# EAGLE design tms-rgb (EAGLE 9.5.1)
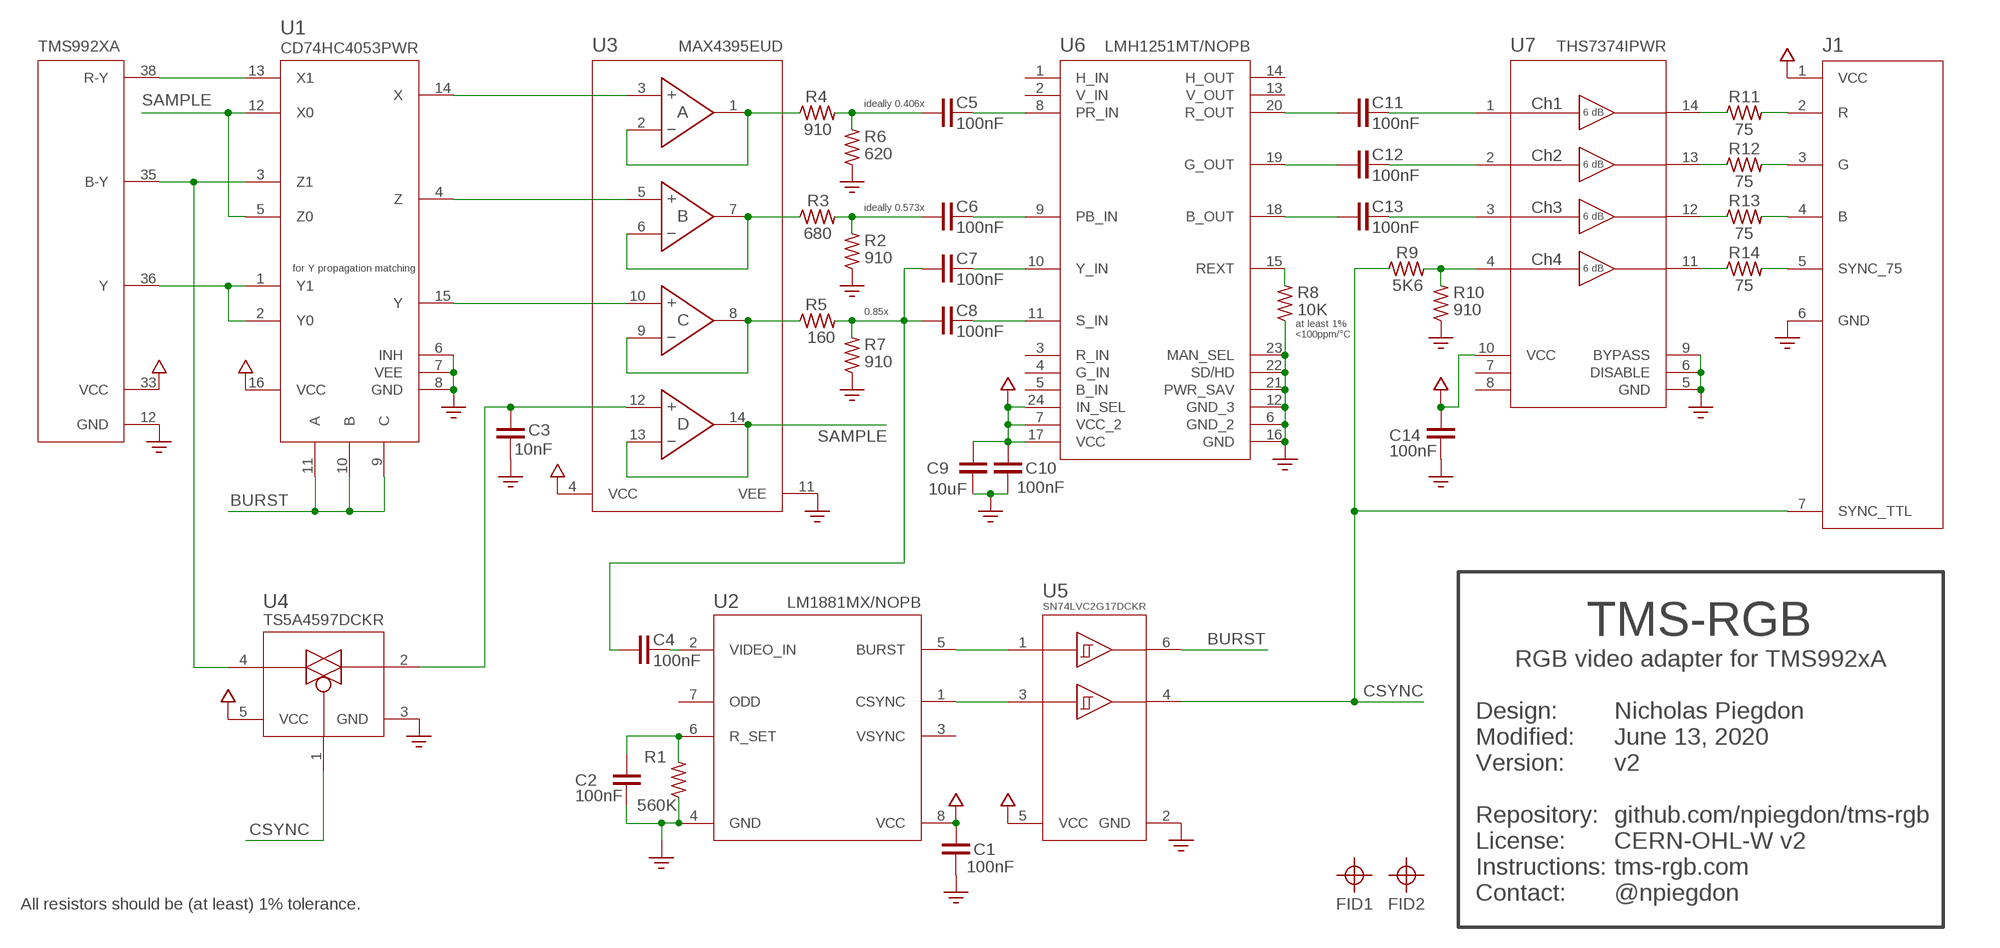
[diagram p0: schematic, sheet 1]

## Parts
C1  100nF  C0603  [C0603]
C2  100nF  C0603  [C0603]
C3  10nF  C0603  [C0603]
C4  100nF  C0603  [C0603]
C5  100nF  C0603  [C0603]
C6  100nF  C0603  [C0603]
C7  100nF  C0603  [C0603]
C8  100nF  C0603  [C0603]
C9  10uF  C1206  [C1206]
C10  100nF  C0603  [C0603]
C11  100nF  C0603  [C0603]
C12  100nF  C0603  [C0603]
C13  100nF  C0603  [C0603]
C14  100nF  C0603  [C0603]
FID1  FIDUCIAL  [FIDUCIAL]
FID2  FIDUCIAL  [FIDUCIAL]
J1  Pads  PADSRGB  [PADS]
R1  560K  R0603  [R0603]
R2  910  R0603  [R0603]
R3  680  R0603  [R0603]
R4  910  R0603  [R0603]
R5  160  R0603  [R0603]
R6  620  R0603  [R0603]
R7  910  R0603  [R0603]
R8  10K  R0603  [R0603]
R9  5K6  R0603  [R0603]
R10  910  R0603  [R0603]
R11  75  R0603  [R0603]
R12  75  R0603  [R0603]
R13  75  R0603  [R0603]
R14  75  R0603  [R0603]
U1  CD74HC4053PWR  [CD74HC4053]
U2  LM1881MX/NOPB  [LM1881]
U3  MAX4395EUD  [MAX4395]
U4  TS5A4597DCKR  [DCK5]
U5  SN74LVC2G17DCKR  [DCK6]
U6  LMH1251MT/NOPB  [LMH1251]
U7  THS7374IPWR  [THS7374]
U100  TMS992XA  [TMS992XA]

## Nets
B: J1.4(B) R13.2
B-Y: U1.3(Z1) U4.4(NC) U100.35(B-Y)
BURST: U1.9(C) U1.10(B) U1.11(A) U5.6(1Y)
CSYNC: J1.7(SYNC_TTL) R9.1 U4.1(IN) U5.4(2Y)
G: J1.3(G) R12.2
GND: C1.2 C2.2 C3.2 C9.2 C10.2 C14.2 J1.6(GND) R1.1 R2.1 R6.1 R7.1 R8.1 R10.1 U1.6(INH) U1.7(VEE) U1.8(GND) U2.4(GND) U3.11(VEE) U4.3(GND) U5.2(GND) U6.6(GND_2) U6.12(GND_3) U6.16(GND) U6.21(PWR_SAV) U6.22(SD/HD) U6.23(MAN_SEL) U7.5(GND) U7.6(DISABLE) U7.9(BYPASS) U100.12(GND)
HOLD: C3.1 U3.12(D+) U4.2(COM)
MX_B: U1.4(Z) U3.5(B+)
MX_R: U1.14(X) U3.3(A+)
MX_Y: U1.15(Y) U3.10(C+)
N$1: R4.1 U3.1(A) U3.2(A-)
N$2: R3.1 U3.6(B-) U3.7(B)
N$3: R5.1 U3.8(C) U3.9(C-)
N$5: U2.5(BURST) U5.1(1A)
N$6: U2.1(CSYNC) U5.3(2A)
N$7: C2.1 R1.2 U2.6(R_SET)
N$11: R8.2 U6.15(REXT)
N$15: R14.1 U7.11(CH4OUT)
N$16: R9.2 R10.2 U7.4(CH4IN)
N$17: R13.1 U7.12(CH3OUT)
N$18: R12.1 U7.13(CH2OUT)
N$19: R11.1 U7.14(CH1OUT)
N$20: C4.2 U2.2(VIDEO_IN)
N$21: C5.2 U6.8(PR_IN)
N$22: C6.2 U6.9(PB_IN)
N$23: C8.2 U6.11(S_IN)
N$24: C7.2 U6.10(Y_IN)
N$25: C11.1 U6.20(R_OUT)
N$26: C12.1 U6.19(G_OUT)
N$27: C13.1 U6.18(B_OUT)
N$28: C11.2 U7.1(CH1IN)
N$29: C12.2 U7.2(CH2IN)
N$30: C13.2 U7.3(CH3IN)
R: J1.2(R) R11.2
R-Y: U1.13(X1) U100.38(R-Y)
S75: J1.5(SYNC_75) R14.2
SAMPLE: U1.5(Z0) U1.12(X0) U3.13(D-) U3.14(D)
SC_B: C6.1 R2.2 R3.2
SC_R: C5.1 R4.2 R6.2
SC_Y: C4.1 C7.1 C8.1 R5.2 R7.2
VCC: C1.1 C9.1 C10.1 C14.1 J1.1(VCC) U1.16(VCC) U2.8(VCC) U3.4(VCC) U4.5(VCC) U5.5(VCC) U6.7(VCC_2) U6.17(VCC) U6.24(IN_SEL) U7.10(VCC) U100.33(VCC) ; supply symbol labelled 5V
Y: U1.1(Y1) U1.2(Y0) U100.36(Y)
Unconnected: U2.3(VSYNC) U2.7(ODD) U6.1(H_IN) U6.2(V_IN) U6.3(R_IN) U6.4(G_IN) U6.5(B_IN) U6.13(V_OUT) U6.14(H_OUT) U7.7(NC_2) U7.8(NC)

## Notes on the sheet
- ideally 0.406x
- ideally 0.573x
- for Y propagation matching
- 0.85x
- at least 1%
  <100ppm/°C
- TMS-RGB
- RGB video adapter for TMS992xA
- Design:
  Modified:
  Version:
  
  Repository:
  License:
  Instructions:
  Contact:
- Nicholas Piegdon
  June 13, 2020
  v2
  
  github.com/npiegdon/tms-rgb
  CERN-OHL-W v2
  tms-rgb.com
  @npiegdon
- All resistors should be (at least) 1% tolerance.

## Library data of the parts
C1-C14 = tms-rgb:C
FID1 FID2 = tms-rgb:FIDUCIAL
J1 = tms-rgb:PADS
R1-R14 = tms-rgb:R: RESISTOR, American symbol
U1 = tms-rgb:CD74HC4053PWR; BUILT_BY: EMA_UL_Team; MANUFACTURER: Texas Instruments; MANUFACTURER_PART_NUMBER: CD74HC4053PWR; VENDOR: Vendor
U2 = tms-rgb:LM1881MX/NOPB; BUILT_BY: EMA_UL_Team; MANUFACTURER_PART_NUMBER: LM1881MX/NOPB; SOURCELIBRARY: National_2014-06-20; VENDOR: Texas Instruments
U3 = tms-rgb:MAX4395EUD; BUILT_BY: EMA_UL_Team; MANUFACTURER_PART_NUMBER: max4395eud+; SOURCELIBRARY: Maxim_2014-06-20; VENDOR: Maxim Integrated Products
U4 = tms-rgb:TS5A4597DCKR; DATASHEET_URL: http://www.ti.com/lit/gpn/TS5A4597; DESCRIPTION: Single-Channel 8-Ohm SPST Analog Switch; FAMILY_NAME: ANALOG SWITCH OR MULTIPLEXER (less than or equal to 5V); GENERIC_PART_NUMBER: TS5A4597; INDUSTRY_STD_PKG_TYPE: SC70; MANUFACTURER: Texas Instruments; MANUFACTURER_PART_NUMBER: TS5A4597DCKR; PACKAGE_DESIGNATOR: DCK; PIN_COUNT: 5; VENDOR: Texas Instruments
U5 = tms-rgb:SN74LVC2G17DCKR; BUILT_BY: EMA_UL_Team; MANUFACTURER: Texas Instruments; MANUFACTURER_PART_NUMBER: SN74LVC2G17DCKR; VENDOR: Texas Instruments
U6 = tms-rgb:LMH1251MT/NOPB
U7 = tms-rgb:THS7374IPWR; BUILT_BY: EMA_UL_Team; MANUFACTURER: Texas Instruments; MANUFACTURER_PART_NUMBER: THS7374IPWR; VENDOR: Texas Instruments
U100 = tms-rgb:TMS992XA: The useful RGB pins from the TMS9928A/TMS9929A

## Board
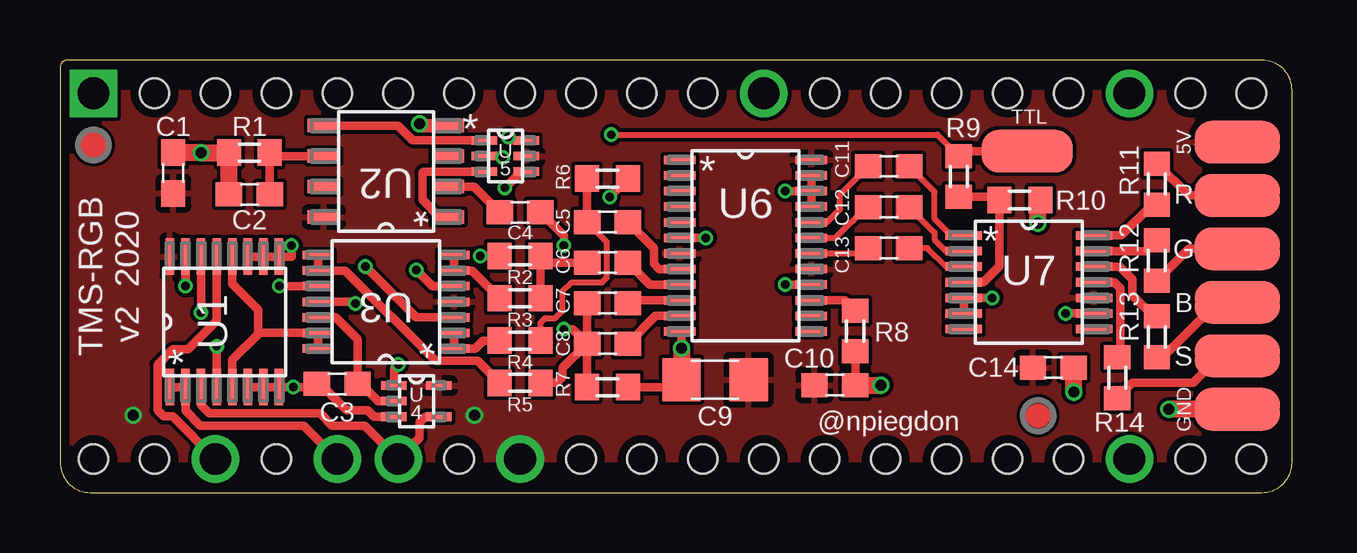
[diagram p1: board, top side]
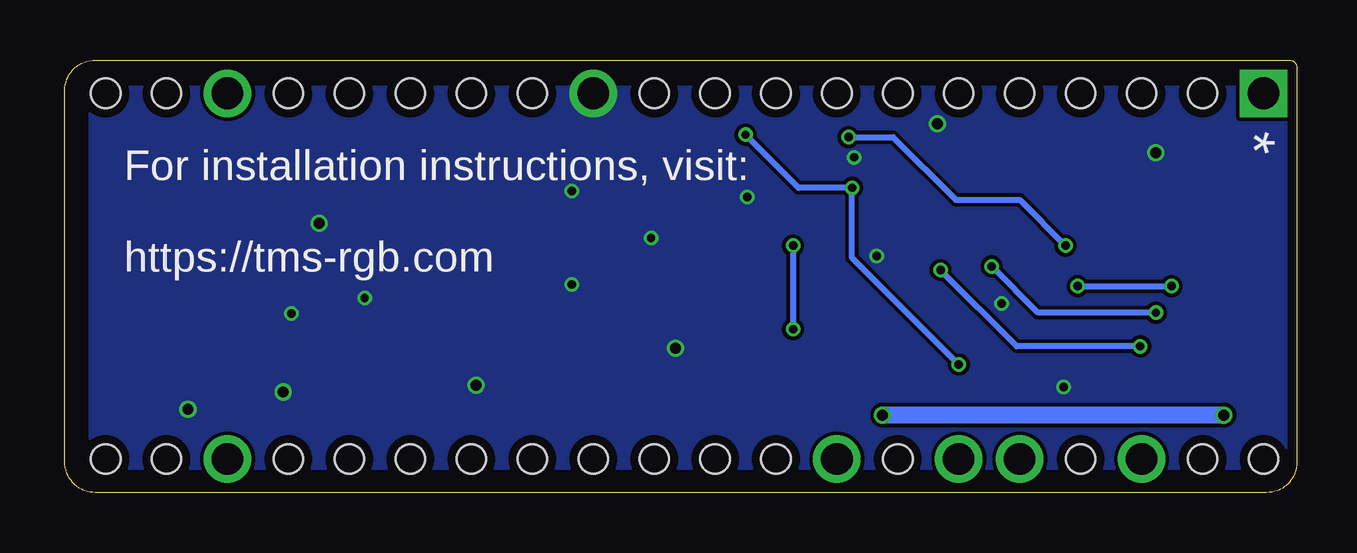
[diagram p2: board, bottom side, seen from below]

Size 51.36 x 18.02 mm. Coordinates in mm from the lower left corner, seen from the top.
Outline: 50.09,18.02 0.32,18.02 arc90 0,17.71 0,1.27 arc90 1.27,0 50.09,0 arc90 51.36,1.27 51.36,16.75 arc90 50.09,18.02
Copper layers (1*16): Top 0.035559375mm / dielectric 1.6mm / Bottom 0.035559375mm
Design rules "oshpark-2layer-tented *": minimum track width 6mil, minimum drill 10mil, track to track 6mil, track to pad 6mil, pad to pad 6mil, via to via 6mil, smd to smd 0mil, copper to edge 15mil, drill to drill 6mil, minimum pad ring 5mil, minimum via ring 5mil, stop-mask expansion 2.5mil, vias tented up to drill 20mil, thermal gap 10mil

### Footprints (pad centres in the part's own frame; a part is rotated, then mirrored left to right if it is on the bottom)
C0603 = smd 1.1 x 1: 1 -0.85,0; 2 0.85,0
C1206 = smd 1.6 x 1.8: 1 -1.4,0; 2 1.4,0
PADS = smd 3.556 x 1.778: 1 0,0; 2 0,-2.227; 3 0,-4.453; 4 0,-6.68; 5 0,-8.907; 6 0,-11.134 | smd 3.81 x 1.778: 7 -8.763,-0.381
R0603 = smd 1 x 1.1: 1 -0.85,0; 2 0.85,0
CD74HC4053 = smd 1.524 x 0.356: 1 -2.718,2.275; 2 -2.718,1.625; 3 -2.718,0.975; 4 -2.718,0.325; 5 -2.718,-0.325; 6 -2.718,-0.975; 7 -2.718,-1.625; 8 -2.718,-2.275; 9 2.718,-2.275; 10 2.718,-1.625; 11 2.718,-0.975; 12 2.718,-0.325; 13 2.718,0.325; 14 2.718,0.975; 15 2.718,1.625; 16 2.718,2.275
LM1881 = smd 1.333 x 0.559: 1 -2.597,1.905; 2 -2.597,0.635; 3 -2.597,-0.635; 4 -2.597,-1.905; 5 2.597,-1.905; 6 2.597,-0.635; 7 2.597,0.635; 8 2.597,1.905
MAX4395 = smd 1.283 x 0.356: 1 -2.838,1.95; 2 -2.838,1.3; 3 -2.838,0.65; 4 -2.838,0; 5 -2.838,-0.65; 6 -2.838,-1.3; 7 -2.838,-1.95; 8 2.838,-1.95; 9 2.838,-1.3; 10 2.838,-0.65; 11 2.838,0; 12 2.838,0.65; 13 2.838,1.3; 14 2.838,1.95
DCK5 = smd 1.067 x 0.356: 1 -0.94,0.65; 2 -0.94,0; 3 -0.94,-0.65; 4 0.94,-0.65; 5 0.94,0.65
DCK6 = smd 1.067 x 0.356: 1 -0.876,0.65; 2 -0.876,0; 3 -0.876,-0.65; 4 0.876,-0.65; 5 0.876,0; 6 0.876,0.65
LMH1251 = smd 1.321 x 0.356: 1 -2.743,3.575; 2 -2.743,2.925; 3 -2.743,2.275; 4 -2.743,1.625; 5 -2.743,0.975; 6 -2.743,0.325; 7 -2.743,-0.325; 8 -2.743,-0.975; 9 -2.743,-1.625; 10 -2.743,-2.275; 11 -2.743,-2.925; 12 -2.743,-3.575; 13 2.743,-3.575; 14 2.743,-2.925; 15 2.743,-2.275; 16 2.743,-1.625; 17 2.743,-0.975; 18 2.743,-0.325; 19 2.743,0.325; 20 2.743,0.975; 21 2.743,1.625; 22 2.743,2.275; 23 2.743,2.925; 24 2.743,3.575
THS7374 = smd 1.524 x 0.356: 1 -2.718,1.95; 2 -2.718,1.3; 3 -2.718,0.65; 4 -2.718,0; 5 -2.718,-0.65; 6 -2.718,-1.3; 7 -2.718,-1.95; 8 2.718,-1.95; 9 2.718,-1.3; 10 2.718,-0.65; 11 2.718,0; 12 2.718,0.65; 13 2.718,1.3; 14 2.718,1.95
TMS992XA = drill 1.321 pad 1.93: 1 0,-43.18; 2 15.24,-43.18; 12 0,-27.94; 33 15.24,-17.78; 35 15.24,-12.7; 36 15.24,-10.16; 38 15.24,-5.08 | drill 1.321 pad 1.93 square: 3 0,0 | hole 1.219: 0,-2.54; 0,-25.4; 0,-22.86; 0,-30.48; 0,-5.08; 0,-7.62; 0,-10.16; 0,-12.7; 0,-15.24; 0,-17.78; 0,-20.32; 0,-45.72; 0,-33.02; 0,-35.56; 0,-38.1; 0,-40.64; 0,-48.26; 15.24,0; 15.24,-2.54; 15.24,-7.62; 15.24,-15.24; 15.24,-20.32; 15.24,-35.56; 15.24,-33.02; 15.24,-22.86; 15.24,-25.4; 15.24,-27.94; 15.24,-30.48; 15.24,-38.1; 15.24,-45.72; 15.24,-40.64; 15.24,-48.26

### Placement (x,y rotation side)
C1  4.72,13.32 90 top
C2  7.9,12.42 180 top
C3  11.56,4.53 180 top
C4  19.18,11.68 180 top
C5  22.82,11.27 0 top
C6  22.82,9.58 0 top
C7  22.82,7.89 0 top
C8  22.82,6.21 0 top
C9  27.3,4.7 180 top
C10  32.3,4.48 0 top
C11  34.54,13.59 0 top
C12  34.54,11.89 0 top
C13  34.54,10.19 0 top
C14  41.4,5.21 0 top
FID1  1.4,14.48 0 top
FID2  40.77,3.2 0 top
J1  49.07,14.61 0 top
R1  7.9,14.17 0 top
R2  19.18,9.86 0 top
R3  19.18,8.1 0 top
R4  19.18,6.33 0 top
R5  19.18,4.57 0 top
R6  22.82,13.08 180 top
R7  22.82,4.39 180 top
R8  33.15,6.73 90 top
R9  37.47,13.17 270 top
R10  40.01,12.19 180 top
R11  45.72,12.85 90 top
R12  45.72,9.67 270 top
R13  45.72,6.49 270 top
R14  44.07,4.79 270 top
U1  6.86,7.11 90 top
U2  13.59,13.39 180 top
U3  13.59,7.95 180 top
U4  14.86,3.81 0 top
U5  18.57,14.02 0 top
U6  28.57,10.29 0 top
U7  40.39,8.76 0 top
U100  1.4,16.64 270 bottom

### Tracks (layer width: path | path; a pad name or v marks a point on that pad's centre or on a via)
B
  Top 0.356: R13.2 45.97,5.64 48.26,7.92 J1.4
B-Y
  Top 0.356: U4.4 15.22,3.16 14.99,2.92 14.99,2.29 U100.35 12.7,2.79 11.35,2.79 10.84,3.3 6.22,3.3 5.88,3.64 U1.3
BURST  (via drill 0.35)
  Top 0.356: U1.11 U1.10 U1.9 9.65,9.83 v9.65,10.29 | U5.6 18.83,14.67 v18.69,14.81
  Bottom 0.254: v18.69,14.81 16.84,14.81 14.22,12.19 11.56,12.19 v9.65,10.29
CSYNC  (via drill 0.35)
  Top 0.254: R9.1 36.57,14.91 v22.99,14.91
  Top 0.356: U4.1 13.92,5.16 v14.1,5.33 | R9.1 37.67,14.22 J1.7 | v18.54,12.7 19.21,13.37 U5.4
  Bottom 0.254: v22.99,14.91 20.78,12.7 v18.54,12.7 18.54,9.78 v14.1,5.33
G
  Top 0.356: R12.2 47.05,10.15 J1.3
GND  (via drill 0.35, 0.46)
  Top 0.356: U7.6 U7.5 v38.86,8.11 | U1.6 U1.7 U1.8 v9.73,4.39 10.57,4.39 C3.2 10.84,4.53 11.94,3.43 12.83,3.43 13.1,3.16 U4.3 | U6.21 U6.22 | U6.22 U6.23 | R7.1 25.6,4.39 | U6.22 v30.23,12.56 | v22.91,12.32 R6.1 | R6.1 | v17.53,9.86 v17.52,9.86 R2.1 | U3.11 12.24,7.95 v12.32,7.87 | U6.12 25.91,6.64 v25.91,6.02 | C10.2 R8.1 | U5.2 18.41,14.02 v18.46,13.97 | U6.6 v26.92,10.61 | v26.92,10.61 | U6.16 v30.23,8.66 | v38.86,8.11 | U7.9 v41.91,7.46
  Top 0.559: U2.4 15.06,15.29 v14.99,15.37
  Top 0.711: C10.2 v34.23,4.48 | v42.25,4.19 C14.2 | C2.2 R1.1 | v40.77,11.23 40.77,12.1 R10.1 | v25.91,6.02 C9.2 25.6,4.39 | C1.2 v5.89,14.17 R1.1 | R1.1 | J1.6 v46.23,3.47
  Top 1.016: 25.6,4.39 C9.2
  pour Bottom (rank 6): -3.43,16.89 -3.43,1.02 50.29,1.02 50.29,16.89
HOLD
  Top 0.356: U4.2 13.25,3.81 12.53,4.53 C3.1 12.41,6.39 11.5,7.3 U3.12
MX_B  (via drill 0.35)
  Top 0.356: U1.4 v6.53,6.1 | v14.86,9.27 15.53,8.6 U3.5
  Bottom 0.254: v6.53,6.1 11.68,6.1 v14.86,9.27
MX_R  (via drill 0.35)
  Top 0.356: U1.14 v5.88,7.49 | v12.73,9.43 14.85,7.3 U3.3
  Bottom 0.254: v12.73,9.43 10.79,7.49 v5.88,7.49
MX_Y  (via drill 0.35)
  Top 0.356: U3.10 v9.14,8.6 | U1.15 v5.23,8.6
  Bottom 0.254: v9.14,8.6 v5.23,8.6
N$1
  Top 0.356: U3.2 U3.1 17.3,6 17.64,6.33 R4.1
N$2
  Top 0.356: U3.7 U3.6 17.17,9.25 R3.1
N$3
  Top 0.356: U3.8 U3.9 11.89,9.25 15.65,5.49 17.41,5.49 R5.1
N$5
  Top 0.356: U2.5 14.09,15.29 14.7,14.68 U5.1
N$6
  Top 0.356: U5.3 15.15,13.37 15.11,13.34 15.11,12.19 15.82,11.48 U2.1
N$7
  Top 0.356: C2.1 R1.2 8.9,14.02 U2.6
N$11
  Top 0.356: U6.15 32.72,8.01 R8.2
N$15
  Top 0.356: U7.11 43.94,8.76 44.2,8.51 44.2,5.76 R14.1
N$16
  Top 0.356: R9.2 39.03,12.32 R10.2 39.16,9.44 38.48,8.76 U7.4
N$17
  Top 0.356: R13.1 45.59,7.34 44.7,8.23 44.7,8.89 44.18,9.41 U7.12
N$18
  Top 0.356: U7.13 45.26,10.06 R12.1
N$19
  Top 0.356: U7.14 44.24,10.71 45.53,12 R11.1
N$20
  Top 0.356: U2.2 17.26,12.75 C4.2
N$21
  Top 0.356: U6.8 24.98,9.31 24.77,9.53 24.77,10.17 C5.2
N$22
  Top 0.356: U6.9 24.59,8.66 C6.2
N$23
  Top 0.356: U6.11 24.82,7.36 C8.2
N$24
  Top 0.356: U6.10 23.79,8.01 C7.2
N$25
  Top 0.254: U6.20 31.96,11.26 32.51,11.81 32.51,12.41 C11.1
N$26
  Top 0.254: U6.19 32.33,10.61 33.61,11.89 C12.1
N$27
  Top 0.254: U6.18 33.47,9.96 C13.1
N$28
  Top 0.254: U7.1 37.15,10.71 36.45,11.41 36.45,12.53 C11.2
N$29
  Top 0.254: C12.2 36.45,10.83 36.45,10.54 36.93,10.06 U7.2
N$30
  Top 0.254: U7.3 36.94,9.41 36.17,10.19 C13.2
R
  Top 0.356: R11.2 47.04,12.38 J1.2
R-Y
  Top 0.356: U100.38 4.7,3.17 4.32,3.17 4.06,3.43 4.06,5.33 4.7,5.97 5.33,5.97 6.53,7.17 U1.13
S75
  Top 0.356: R14.2 44.7,4.57 47.24,4.57 48.01,5.33 48.01,5.46 48.24,5.7 J1.5
SAMPLE
  Top 0.356: U3.14 U3.13 8.3,6.65 8.26,6.6 | U1.5 7.18,5.53 8.26,6.6 | 8.26,6.6 8.26,7.62 7.18,8.69 U1.12
SC_B
  Top 0.356: R3.2 20.03,9.65 | 20.03,9.65 R2.2 | C6.1 20.1,9.58 20.03,9.65
SC_R
  Top 0.254: R4.2 20.03,7.07 20.22,7.27 20.64,7.27 20.95,7.58 20.95,8.38 21.34,8.76 22.6,8.76 22.8,8.96 22.8,10.44 C5.1
  Top 0.356: C5.1 R6.2
SC_Y  (via drill 0.35)
  Top 0.356: C8.1 R7.2 | C8.1 C7.1 | C8.1 20.95,5.19 20.95,4.83 20.7,4.57 R5.2 | v21.01,6.81 21.37,6.81 C8.1 | C4.1 21.01,10.71 v21.01,10.29
  Bottom 0.254: v21.01,10.29 v21.01,6.81
VCC  (via drill 0.46)
  Bottom 0.711: v3.05,3.23 v17.27,3.23
  pour Top (rank 6): -1.27,16.64 -1.27,1.4 47.5,1.4 47.5,16.64
Y
  Top 0.356: U1.1 U1.2 5.23,3.4 5.84,2.79 10.16,2.79 U100.36

### Text on the board
bPlace: For installation instructions, visit: / / https://tms-rgb.com
tNames: TTL | 5V | U / 5 | R | G | TMS-RGB / v2 2020 | B | S | U / 4 | @npiegdon | GND